# Altium schematic sheet ROBOT_SCH.SchDoc
size A4
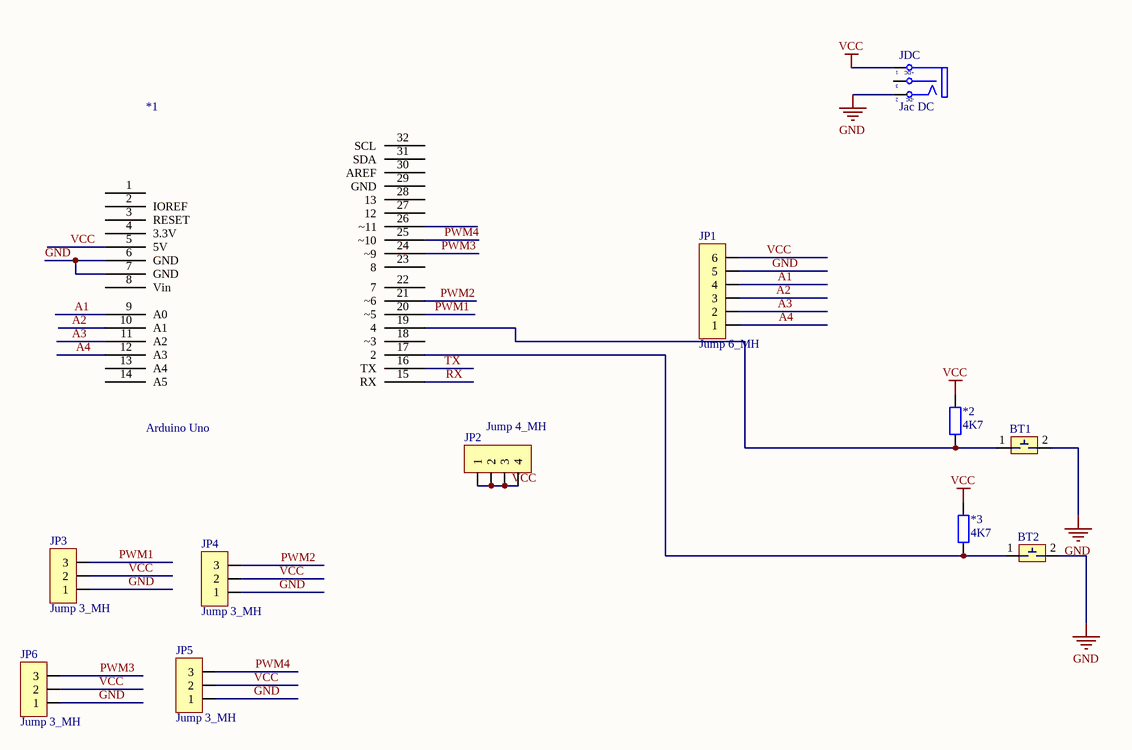
[diagram p0: ROBOT_SCH.SchDoc]

## Parts
*1  Arduino Uno  [ARDUINO UNO]
*2  4K7  [Tro SMD 0805]
*3  4K7  [Tro SMD 0805]
BT1  BUTTON 4P 6x6_MH  [BUTTON 4 PIN(6*6)]  (value not drawn)
BT2  BUTTON 4P 6x6_MH  [BUTTON 4 PIN(6*6)]  (value not drawn)
JDC  Jac DC  [DC-IN]
JP1  Jump 6_MH  [Jump 6]
JP2  Jump 4_MH  [Jump 4]
JP3  Jump 3_MH  [Jump 3]
JP4  Jump 3_MH  [Jump 3]
JP5  Jump 3_MH  [Jump 3]
JP6  Jump 3_MH  [Jump 3]

## Nets
GND: *1.6(GND) *1.7(GND) BT1.2 BT2.2 JDC.2(TN) JP1.5 JP3.1 JP4.1 JP5.1 JP6.1
VCC: *1.5(5V) *2.2 *3.2 JDC.1(T) JP1.6 JP2.1 JP2.2 JP2.3 JP2.4 JP3.2 JP4.2 JP5.2 JP6.2
A1: *1.9(A0) JP1.4
A2: *1.10(A1) JP1.3
A3: *1.11(A2) JP1.2
A4: *1.12(A3) JP1.1
PWM1: *1.20(~5) JP3.3
PWM2: *1.21(~6) JP4.3
PWM3: *1.24(~9) JP6.3
PWM4: *1.25(~10) JP5.3
RX: *1.15(RX)
TX: *1.16(TX)
Net*1_17: *1.17(2) *3.1 BT2.1
Net*1_19: *1.19(4) *2.1 BT1.1

Not connected (* = marked no-connect by the designer): *1 1 2(IOREF) 3(RESET) 4(3.3V) 8(Vin) 13(A4) 14(A5) 18(~3) 22(7) 23(8) 26(~11) 27(12) 28(13) 29(GND) 30(AREF) 31(SDA) 32(SCL); JDC 3(S)

## Notes on the sheet
- MicroController Academy
- Người Vẽ   :
- Phiên Bản  :
- Bản Vẽ   :
- Kích Thước:
- Ngày Vẽ :
- A4
- File:
- (in symbol JAC_DC_MH) +DC; -DC

## Library data of the parts
*2 *3 = TRO_SMD_0805_MH: TRO_SMD_0805
BT1 BT2 = BUTTON 4P 6x6_MH: Nút nhấn 4 chân, 6x6mm, cắm
JDC = JAC_DC_MH: Jac DC input; Value: Jac DC
JP1 = Jump 6_MH: Jump 6P 2.54
JP2 = Jump 4_MH: Jump 4P 2.54
JP3-JP6 = Jump 3_MH: Jump 3P 2.54